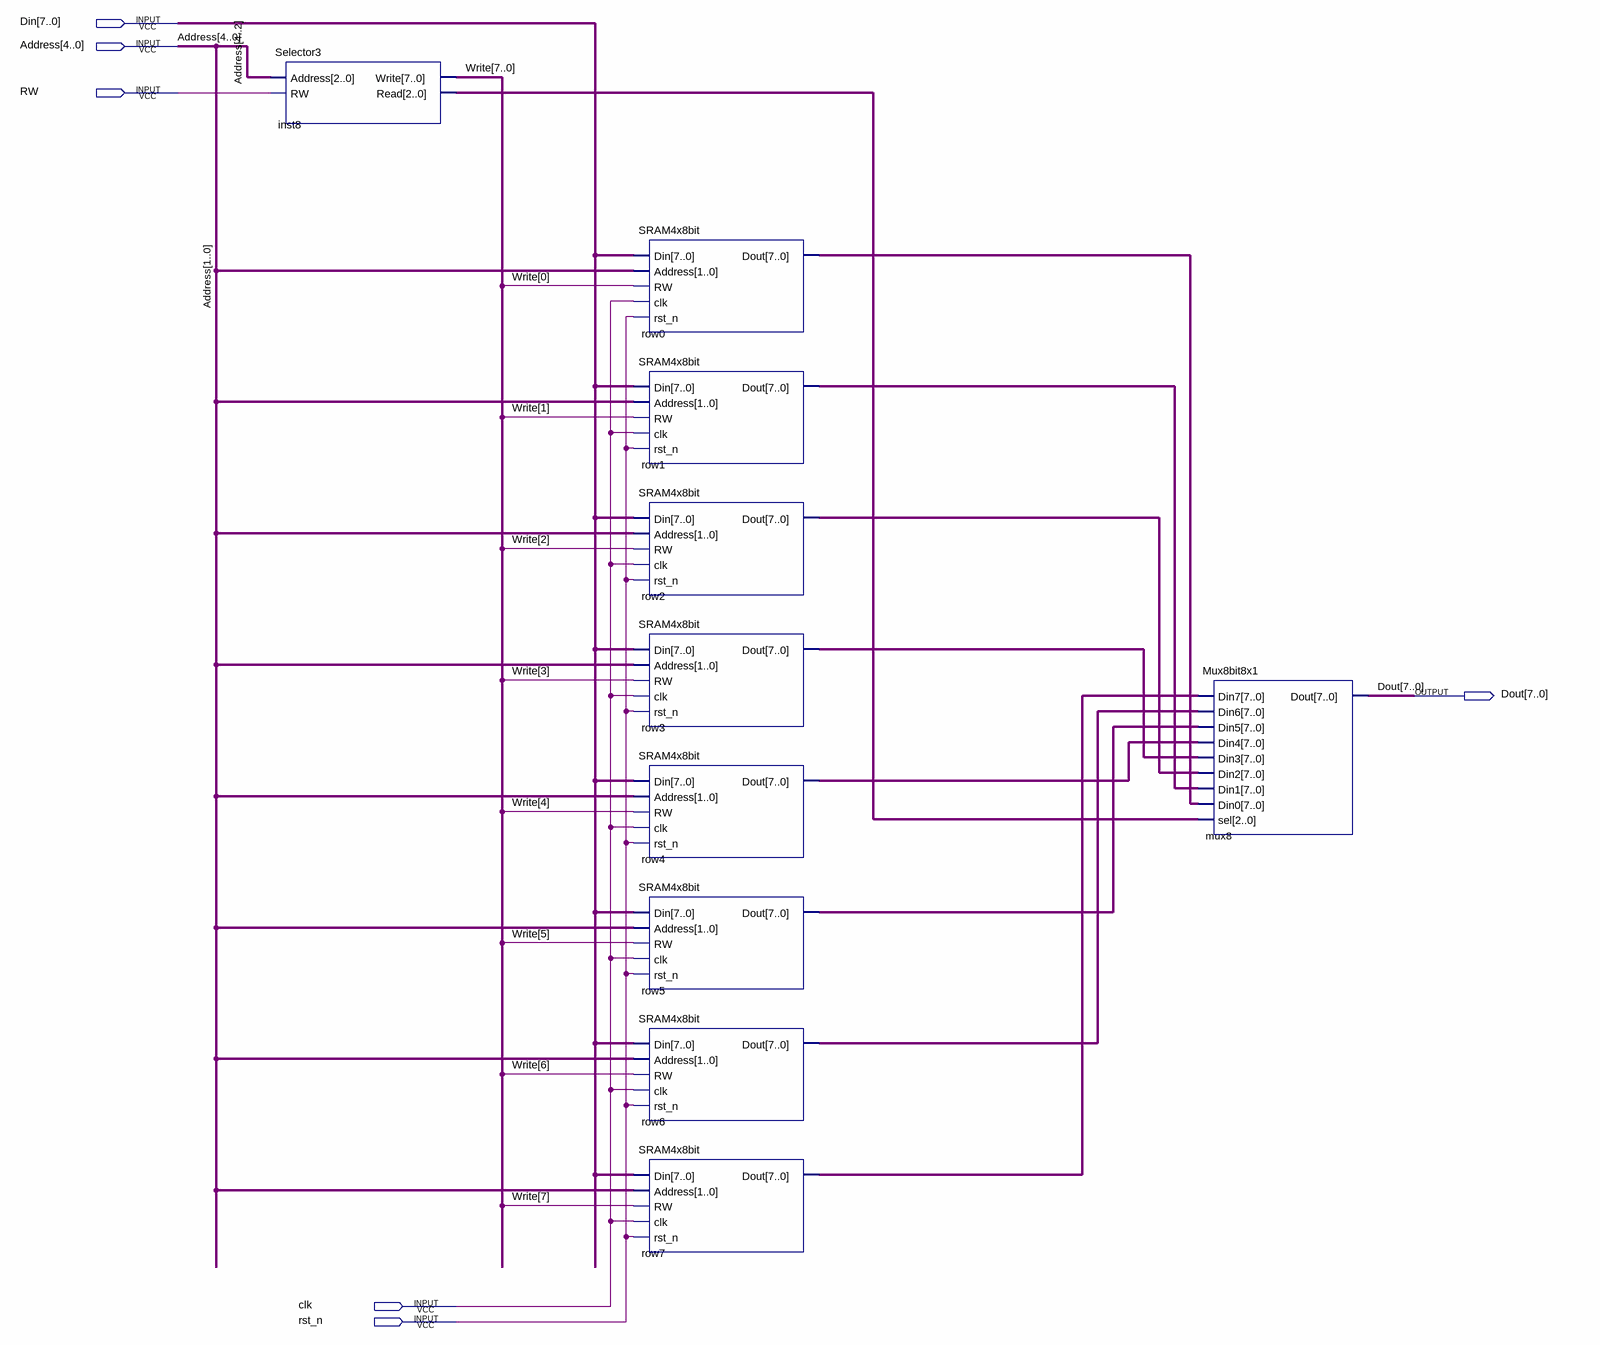
[diagram p0: schematic sheet]
// Quartus schematic SRAM32x8bit.bdf as structural Verilog: 10 symbols, 6 pins
module SRAM32x8bit (
  input  [7:0] Din,
  input  [4:0] Address,
  input  RW,
  input  clk,
  input  rst_n,
  output [7:0] Dout
);

  wire [2:0] inst8_read;
  wire [7:0] row0_dout, row1_dout, row2_dout, row3_dout, row4_dout, row5_dout, row6_dout, row7_dout, Write;

  Selector3 inst8 (.Address(Address[4:2]), .RW(RW), .Write(Write), .Read(inst8_read));
  SRAM4x8bit row0 (.Din(Din), .Address(Address[1:0]), .RW(Write[0]), .clk(clk), .rst_n(rst_n), .Dout(row0_dout));
  SRAM4x8bit row1 (.Din(Din), .Address(Address[1:0]), .RW(Write[1]), .clk(clk), .rst_n(rst_n), .Dout(row1_dout));
  SRAM4x8bit row2 (.Din(Din), .Address(Address[1:0]), .RW(Write[2]), .clk(clk), .rst_n(rst_n), .Dout(row2_dout));
  SRAM4x8bit row3 (.Din(Din), .Address(Address[1:0]), .RW(Write[3]), .clk(clk), .rst_n(rst_n), .Dout(row3_dout));
  SRAM4x8bit row4 (.Din(Din), .Address(Address[1:0]), .RW(Write[4]), .clk(clk), .rst_n(rst_n), .Dout(row4_dout));
  SRAM4x8bit row5 (.Din(Din), .Address(Address[1:0]), .RW(Write[5]), .clk(clk), .rst_n(rst_n), .Dout(row5_dout));
  SRAM4x8bit row6 (.Din(Din), .Address(Address[1:0]), .RW(Write[6]), .clk(clk), .rst_n(rst_n), .Dout(row6_dout));
  SRAM4x8bit row7 (.Din(Din), .Address(Address[1:0]), .RW(Write[7]), .clk(clk), .rst_n(rst_n), .Dout(row7_dout));
  Mux8bit8x1 mux8 (
    .Din7(row7_dout), .Din6(row6_dout), .Din5(row5_dout), .Din4(row4_dout), .Din3(row3_dout),
    .Din2(row2_dout), .Din1(row1_dout), .Din0(row0_dout), .sel(inst8_read), .Dout(Dout));
endmodule
